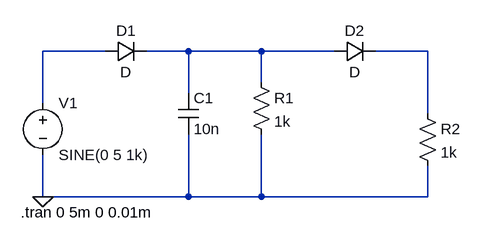
[diagram p0: schematic Draft1.asc]
Draft1.asc, the LTspice schematic file:
Version 4
SHEET 1 880 680
WIRE 224 64 128 64
WIRE 352 64 288 64
WIRE 464 64 352 64
WIRE 576 64 464 64
WIRE 720 64 640 64
WIRE 464 112 464 64
WIRE 352 128 352 64
WIRE 128 144 128 64
WIRE 720 160 720 64
WIRE 128 288 128 224
WIRE 352 288 352 192
WIRE 352 288 128 288
WIRE 464 288 464 192
WIRE 464 288 352 288
WIRE 720 288 720 240
WIRE 720 288 464 288
FLAG 128 288 0
SYMBOL voltage 128 128 R0
WINDOW 123 0 0 Left 0
WINDOW 39 0 0 Left 0
SYMATTR InstName V1
SYMATTR Value SINE(0 5 1k)
SYMBOL diode 224 80 R270
WINDOW 0 32 32 VTop 2
WINDOW 3 0 32 VBottom 2
SYMATTR InstName D1
SYMBOL cap 336 128 R0
SYMATTR InstName C1
SYMATTR Value 10n
SYMBOL res 448 96 R0
SYMATTR InstName R1
SYMATTR Value 1k
SYMBOL diode 576 80 R270
WINDOW 0 32 32 VTop 2
WINDOW 3 0 32 VBottom 2
SYMATTR InstName D2
SYMBOL res 704 144 R0
SYMATTR InstName R2
SYMATTR Value 1k
TEXT 94 312 Left 2 !.tran 0 5m 0 0.01m

The netlist it stands for:
* Draft1.asc
V1 N001 0 SINE(0 5 1k)
D1 N001 N002 D
C1 N002 0 10n
R1 N002 0 1k
D2 N002 N003 D
R2 N003 0 1k
.model D D
.lib standard.dio
.tran 0 5m 0 0.01m
.backanno
.end